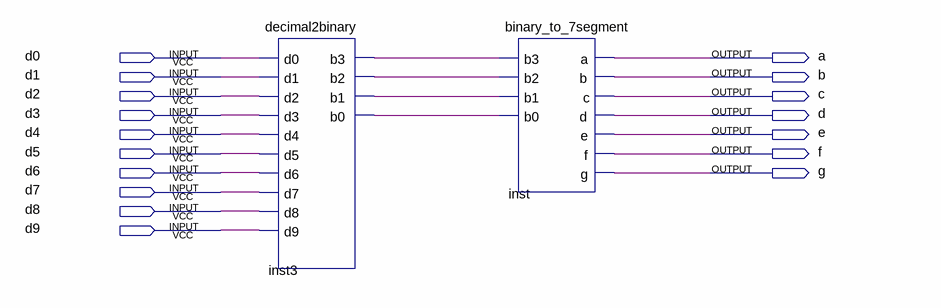
[diagram p0: schematic sheet]
// Quartus schematic week10_1.bdf as structural Verilog: 2 symbols, 17 pins
module week10_1 (
  input  d0,
  input  d1,
  input  d2,
  input  d3,
  input  d4,
  input  d5,
  input  d6,
  input  d7,
  input  d8,
  input  d9,
  output a,
  output b,
  output c,
  output d,
  output e,
  output f,
  output g
);

  wire inst3_b0, inst3_b1, inst3_b2, inst3_b3;

  decimal2binary inst3 (
    .d0(d0), .d1(d1), .d2(d2), .d3(d3), .d4(d4), .d5(d5), .d6(d6), .d7(d7), .d8(d8), .d9(d9), .b3(inst3_b3),
    .b2(inst3_b2), .b1(inst3_b1), .b0(inst3_b0));
  binary_to_7segment inst (
    .b3(inst3_b3), .b2(inst3_b2), .b1(inst3_b1), .b0(inst3_b0), .a(a), .b(b), .c(c), .d(d), .e(e), .f(f),
    .g(g));
endmodule
